# Altium schematic sheet TECController.SchDoc
size Tabloid; Organization: MIT; SheetNumber: 5; SheetTotal: 5; Section: TEC Controller
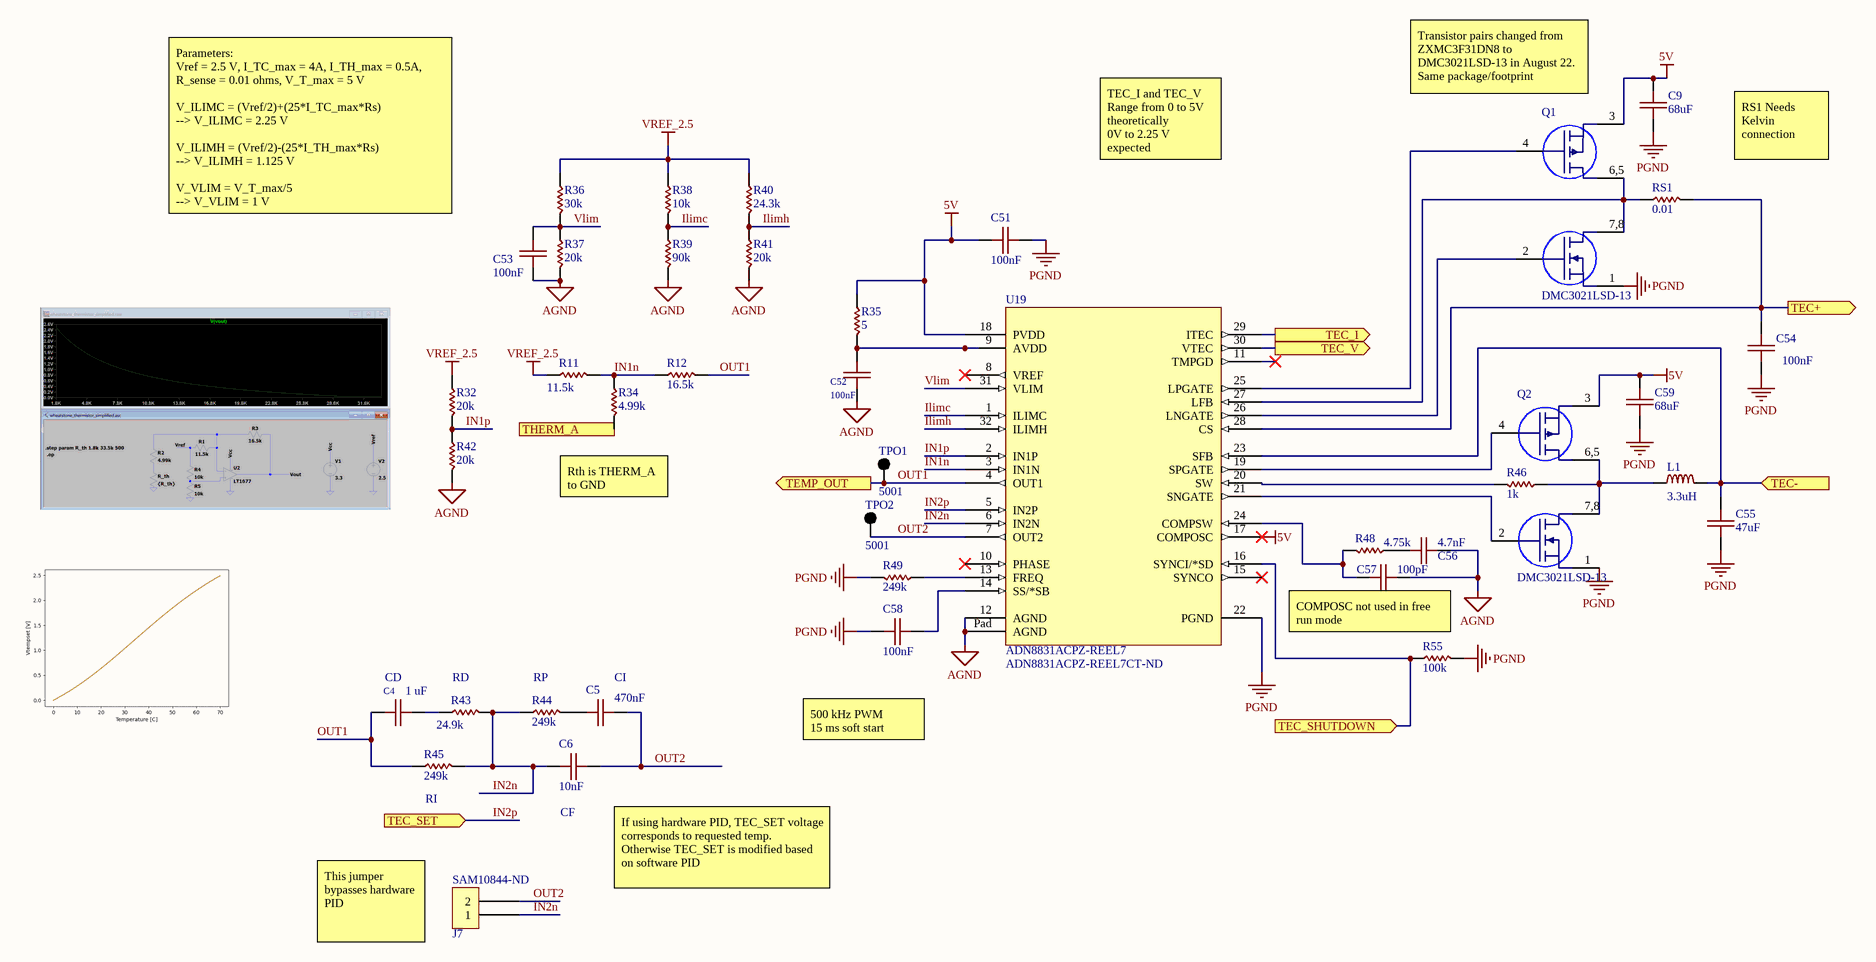
[diagram p0: TECController.SchDoc]

## Parts
C4  value 1 uF  [0603 B]
C5  value 470nF  [0603 B]
C6  10nF  [0603 B]
C9  68uF  [1206 B]
C51  100nF  [0603 B]
C52  100nF  [0603 B]
C53  100nF  [0603 B]
C54  100nF  [0603 B]
C55  47uF  [0805 B]
C56  4.7nF  [0603 B]
C57  100pF  [0603 B]
C58  100nF  [0603 B]
C59  68uF  [1206 B]
J7  Supplier Part Number 1: SAM10844-ND  [SIL02]  (hidden comment: SIL02)
L1  3.3uH  [SRP0520]
Q1  Supplier Part Number 1: DMC3021LSD-13  [SO-8]  (hidden comment: FDS8960C)
Q2  Supplier Part Number 1: DMC3021LSD-13  [SO-8]  (hidden comment: FDS8960C)
R11  value 11.5k  [0603]
R12  16.5k  [0603]
R32  20k  [0603]
R34  4.99k  [0603]
R35  5  [0805]
R36  30k  [0603]
R37  20k  [0603]
R38  10k  [0603]
R39  90k  [0603]
R40  24.3k  [0603]
R41  20k  [0603]
R42  20k  [0603]
R43  24.9k  [0603]
R44  249k  [0603]
R45  249k  [0603]
R46  1k  [0603]
R48  4.75k  [0603]
R49  249k  [0603]
R55  100k  [0603]
RS1  0.01  [1206]
TPO1  5001  [KSTN-5001]
TPO2  5001  [KSTN-5001]
U19  ADN8831ACPZ-REEL7  Supplier Part Number 1: ADN8831ACPZ-REEL7CT-ND  [LFCSP CP 32 7]

## Ports
TEC+ (out), TEC- (in), TEC_I (out), TEC_SET (in), TEC_SHUTDOWN (in), TEC_V (out), TEMP_OUT (out), THERM_A

## Nets
5V: C9.2 C51.1 C59.2 Q1.3 Q2.3 R35.2 U19.17(COMPOSC) U19.18(PVDD)
AGND: C52.2 C53.2 C56.2 C57.2 R37.1 R39.1 R41.1 R42.1 U19.12(AGND) U19.Pad(AGND)
PGND: C9.1 C51.2 C54.1 C55.1 C58.1 C59.1 Q1.1 Q2.1 R49.1 R55.1 U19.22(PGND)
VREF_2.5: R11.2 R32.2 R36.2 R38.2 R40.2
Ilimc: R38.1 R39.2 U19.1(ILIMC)
Ilimh: R40.1 R41.2 U19.32(ILIMH)
IN1n: R11.1 R12.2 R34.2 U19.3(IN1N)
IN1p: R32.1 R42.2 U19.2(IN1P)
IN2n: C6.1 J7.1 R43.1 R44.2 R45.1 U19.6(IN2N)
IN2p: U19.5(IN2P) ; port TEC_SET
OUT1: C4.1 R12.1 R45.2 TPO1.1 U19.4(OUT1) ; port TEMP_OUT
OUT2: C5.2 C6.2 J7.2 TPO2.1 U19.7(OUT2)
TEC+: C54.2 RS1.1 U19.28(CS) ; port TEC+
TEC-: C55.2 L1.1 U19.23(SFB) ; port TEC-
TEC_I: U19.29(ITEC) ; port TEC_I
TEC_SHUTDOWN: R55.2 U19.16(SYNCI/*SD) ; port TEC_SHUTDOWN
TEC_V: U19.30(VTEC) ; port TEC_V
THERM_A: R34.1 ; port THERM_A
Vlim: C53.1 R36.1 R37.2 U19.31(VLIM)
NetC4_2: C4.2 R43.2
NetC5_1: C5.1 R44.1
NetC52_1: C52.1 R35.1 U19.9(AVDD)
NetC56_1: C56.1 R48.2
NetC57_1: C57.1 R48.1 U19.24(COMPSW)
NetC58_2: C58.2 U19.14(SS/*SB)
NetL1_2: L1.2 Q2.6,5 Q2.7,8 R46.2
NetQ1_2: Q1.2 U19.26(LNGATE)
NetQ1_4: Q1.4 U19.25(LPGATE)
NetQ1_6,5: Q1.6,5 Q1.7,8 RS1.2 U19.27(LFB)
NetQ2_2: Q2.2 U19.21(SNGATE)
NetQ2_4: Q2.4 U19.19(SPGATE)
NetR46_1: R46.1 U19.20(SW)
NetR49_2: R49.2 U19.13(FREQ)

Not connected (* = marked no-connect by the designer): U19 8(VREF)* 10(PHASE)* 11(TMPGD)* 15(SYNCO)*

## Notes on the sheet
- (near Q1) Transistor pairs changed from ZXMC3F31DN8 to DMC3021LSD-13 in August 22. Same package/footprint
- Parameters:
  Vref = 2.5 V, I_TC_max = 4A, I_TH_max = 0.5A, R_sense = 0.01 ohms, V_T_max = 5 V
  V_ILIMC = (Vref/2)+(25*I_TC_max*Rs)
  --> V_ILIMC = 2.25 V
  V_ILIMH = (Vref/2)-(25*I_TH_max*Rs)
  --> V_ILIMH = 1.125 V
  V_VLIM = V_T_max/5
  --> V_VLIM = 1 V
- TEC_I and TEC_V
  Range from 0 to 5V theoretically
  0V to 2.25 V expected
- RS1 Needs Kelvin connection
- (near R34) Rth is THERM_A to GND
- (near C4) CD
- (near R43) RD
- (near R44) RP
- (near C5) CI
- (near C57) COMPOSC not used in free run mode
- 500 kHz PWM
  15 ms soft start
- (near R45) RI
- (near C6) CF
- (near C6) If using hardware PID, TEC_SET voltage corresponds to requested temp. Otherwise TEC_SET is modified based on software PID
- This jumper bypasses hardware PID
- Title
- Size
- Date
- Tabloid
- Section
- Time
- Sheet
- of
- Revision
- Drawn
- 33-207 / 77 Mass. Ave.
- Cambridge, MA 02139
- File

## Library data of the parts
C4-C6 C51-C54 C56-C58 = CAP 0603: 603 Capacitor
  C6: Value: 10nF
  C51-C54 C58: Value: 100nF
  C56: Value: 4.7nF
  C57: Value: 100pF
C9 C59 = CAP 1206: 1206 Capacitor; Value: 68uF
C55 = CAP 0805: 805 Capacitor; Value: 47uF
J7 = SIL02: Conn Unshrouded Header HDR 2 POS 2.54mm Solder ST Top Entry Thru-Hole Bag; Manufacturer: Samtec; Manufacturer Part Number: TSW-102-07-F-S; Ref: 4x1 2.54MM HEADER; Number of Contacts: 2; Gender: Male; Max Current Rating: 7.6A; Max Voltage Rating (AC): 550V; Supplier 1: Digi-Key; RoHS: Yes; Category: Headers and Wire Housings; Stock 1: 35041; Pricing 1: 1=0.30000, 10=0.25500, 100=0.19800, 500=0.16968, 1000=0.14140, 5000=0.12120, 10000=0.11312 (USD); Mount: Through Hole; Contact Plating: Gold; Contact Material: Bronze; Color: Black; Housing Color: Black; Housing Material: Polyester; Contact Shape: Square; Contact Finish - Mating: GOLD; Insulation Material: PBT; Insulation Color: Black; Min Operating Temperature: -55°C; Max Operating Temperature: 125°C; Number of Rows: 1; Termination: Solder; Packaging: Bag; Number of Positions: 2; Orientation: Straight; Connector Type: Header; Fastening Type: Pull; Series: TSW; Contact Type: Male Pin; Package Quantity: 1; Length: 5.08mm; Pitch: 2.54mm; Contact Mating Length: 0.23inch; Depth: 2.54mm; Radiation Hardening: No; RoHS Compliant: Yes; Reach SVHC Compliant: Yes; Flammability Rating: UL94 V-0; ComponentLink1URL: https://datasheet.ciiva.com/739/tsw-xxx-xx-xxx-x-xx-xxx-mkt-739881.pdf?src-supplier=Digi-Key; ComponentLink1Description: https://datasheet.ciiva.com/739/tsw-xxx-xx-xxx-x-xx-xxx-mkt-739881.pdf?src-supplier=Digi-Key; ComponentLink2URL: https://datasheet.ciiva.com/10281/htsw-th-10281262.pdf?src-supplier=Avnet; ComponentLink2Description: https://datasheet.ciiva.com/10281/htsw-th-10281262.pdf?src-supplier=Avnet
L1 = IND 3.3uH 4.8A SMD: Bourns SRP0520 3.3uH 4.8A Inductor; Ref: IHLP3232DZER330M11; Value: 3.3uH
Q1 Q2 = DMC3021LSD: Trans Mosfet N/p-ch 30V 8.5A/7A 8-PIN SOIC T/r; Manufacturer: Diodes; Gate to Source Voltage (Vgs): 20V; Rds On Max: 21mR; Input Capacitance: 767pF; Number of Elements: 2; Max Power Dissipation: 2.5W; Continuous Drain Current (ID): 8.5A; Drain to Source Resistance: 14mR; Turn-Off Delay Time: 50.1ns; FET Type: N and P-Channel; Polarity: N-CHANNEL,P-CHANNEL; Supplier 1: Arrow Electronics; Manufacturer Part Number: DMC3021LSD-13; RoHS: Yes; Category: MOSFETs; Stock 1: 2500; Pricing 1: 1=0,52330, 10=0,42450, 25=0,42030, 100=0,30620, 250=0,30310, 500=0,23740, 1000=0,20330 (USD); Mount: Surface Mount; Case/Package: SOIC; Number of Pins: 8; Weight: 0.00261oz; Min Operating Temperature: -55°C; Max Operating Temperature: 150°C; Packaging: Tape and Reel; Package Quantity: 2500; Power Dissipation: 2.5W; Drain to Source Voltage (Vdss): 30V; Number of Channels: 2; Series: -; Length: 4.95mm; Width: 3.95mm; Height: 1.5mm; Radiation Hardening: No; REACH SVHC: No SVHC; RoHS Compliant: Yes; ComponentLink1URL: https://datasheet.ciiva.com/4443/ds32152-88645-4443219.pdf?src-supplier=Mouser; ComponentLink1Description: https://datasheet.ciiva.com/4443/ds32152-88645-4443219.pdf?src-supplier=Mouser; ComponentLink2URL: https://datasheet.ciiva.com/928/ds32152-928775.pdf?src-supplier=Digi-Key; ComponentLink2Description: https://datasheet.ciiva.com/928/ds32152-928775.pdf?src-supplier=Digi-Key; ComponentLink3URL: https://datasheet.ciiva.com/928/ds32152-928776.pdf?src-supplier=Digi-Key; ComponentLink3Description: https://datasheet.ciiva.com/928/ds32152-928776.pdf?src-supplier=Digi-Key; ComponentLink4URL: https://datasheet.ciiva.com/928/ds32152-928777.pdf?src-supplier=Digi-Key; ComponentLink4Description: https://datasheet.ciiva.com/928/ds32152-928777.pdf?src-supplier=Digi-Key
R11 R12 R32 R34 R36-R46 R48 R49 R55 = RES 0603: 603 Resistor
  R12: Value: 16.5k
  R32 R37 R41 R42: Value: 20k
  R34: Value: 4.99k
  R36: Value: 30k
  R38: Value: 10k
  R39: Value: 90k
  R40: Value: 24.3k
  R43: Value: 24.9k
  R44 R45 R49: Value: 249k
  R46: Value: 1k
  R48: Value: 4.75k
  R55: Value: 100k
R35 = RES 0805: 805 Resistor; Value: 5
RS1 = RES 1206: 1206 Resistor; Value: 0.01; Supplier 1: Digi-Key; Supplier Part Number 1: P.010AUCT-ND
TPO1 TPO2 = CMP-2000-05181-1: Test Point, Black, 1-Pin THD, RoHS, Bulk; Manufacturer: Keystone; Other Names: 5001K; Catalog Drawings: 5000Series; Alternate Color: 5004K-ND / -TESTPOINTPCMINI.040"DYELLOW / 5003K-ND / -TESTPOINTPCMINI.040"DORANGE / 5002K-ND / -TESTPOINTPCMINI.040"DWHITE / 5000K-ND / -TESTPOINTPCMINI.040"DRED; Kits: DKTGRS232C-KIT-ND / -TTLCONVERTER; Online Catalog: ColorCodedTestPoints; Datasheet URL: https://ciiva.com/datasheet-click-2917627?src=ciiva&sig=bd195616; Mounting Type: 0.040"(1.02mm)HoleDiameter; Family: TestPoints; RoHS Information: RoHSComplianceStatement; Datasheet Version: Rev. G, 12/2008; Color: Black; Category: TestandMeasurement; Standard Package: 100; Manufacturer URL: http://www.keyelco.com/; Material: Base,Nylon46,UL94V-0; Type: PCTestPoint,Miniature; Terminal: 0.010"x0.020"(0.25mmx0.51mm)PhosphorBronzeWire,SilverPlated; Series: THM; Packaging: Bulk
U19 = ADN8831ACPZ-REEL7: A High Efficiency TEC Controller Solution; SourceLibrary: Analog_2015-01-06; Built_By: EMA_UL_Team; Vendor: Analog Devices Inc; Manufacturer_Part_Number: ADN8831ACPZ-REEL7; Copyright: Copyright (C) 2018 Accelerated Designs. All rights reserved; RefDes: RefDes; Type: DEV; Supplier 1: Digi-Key